# Altium project PCB_intern.PrjPcb
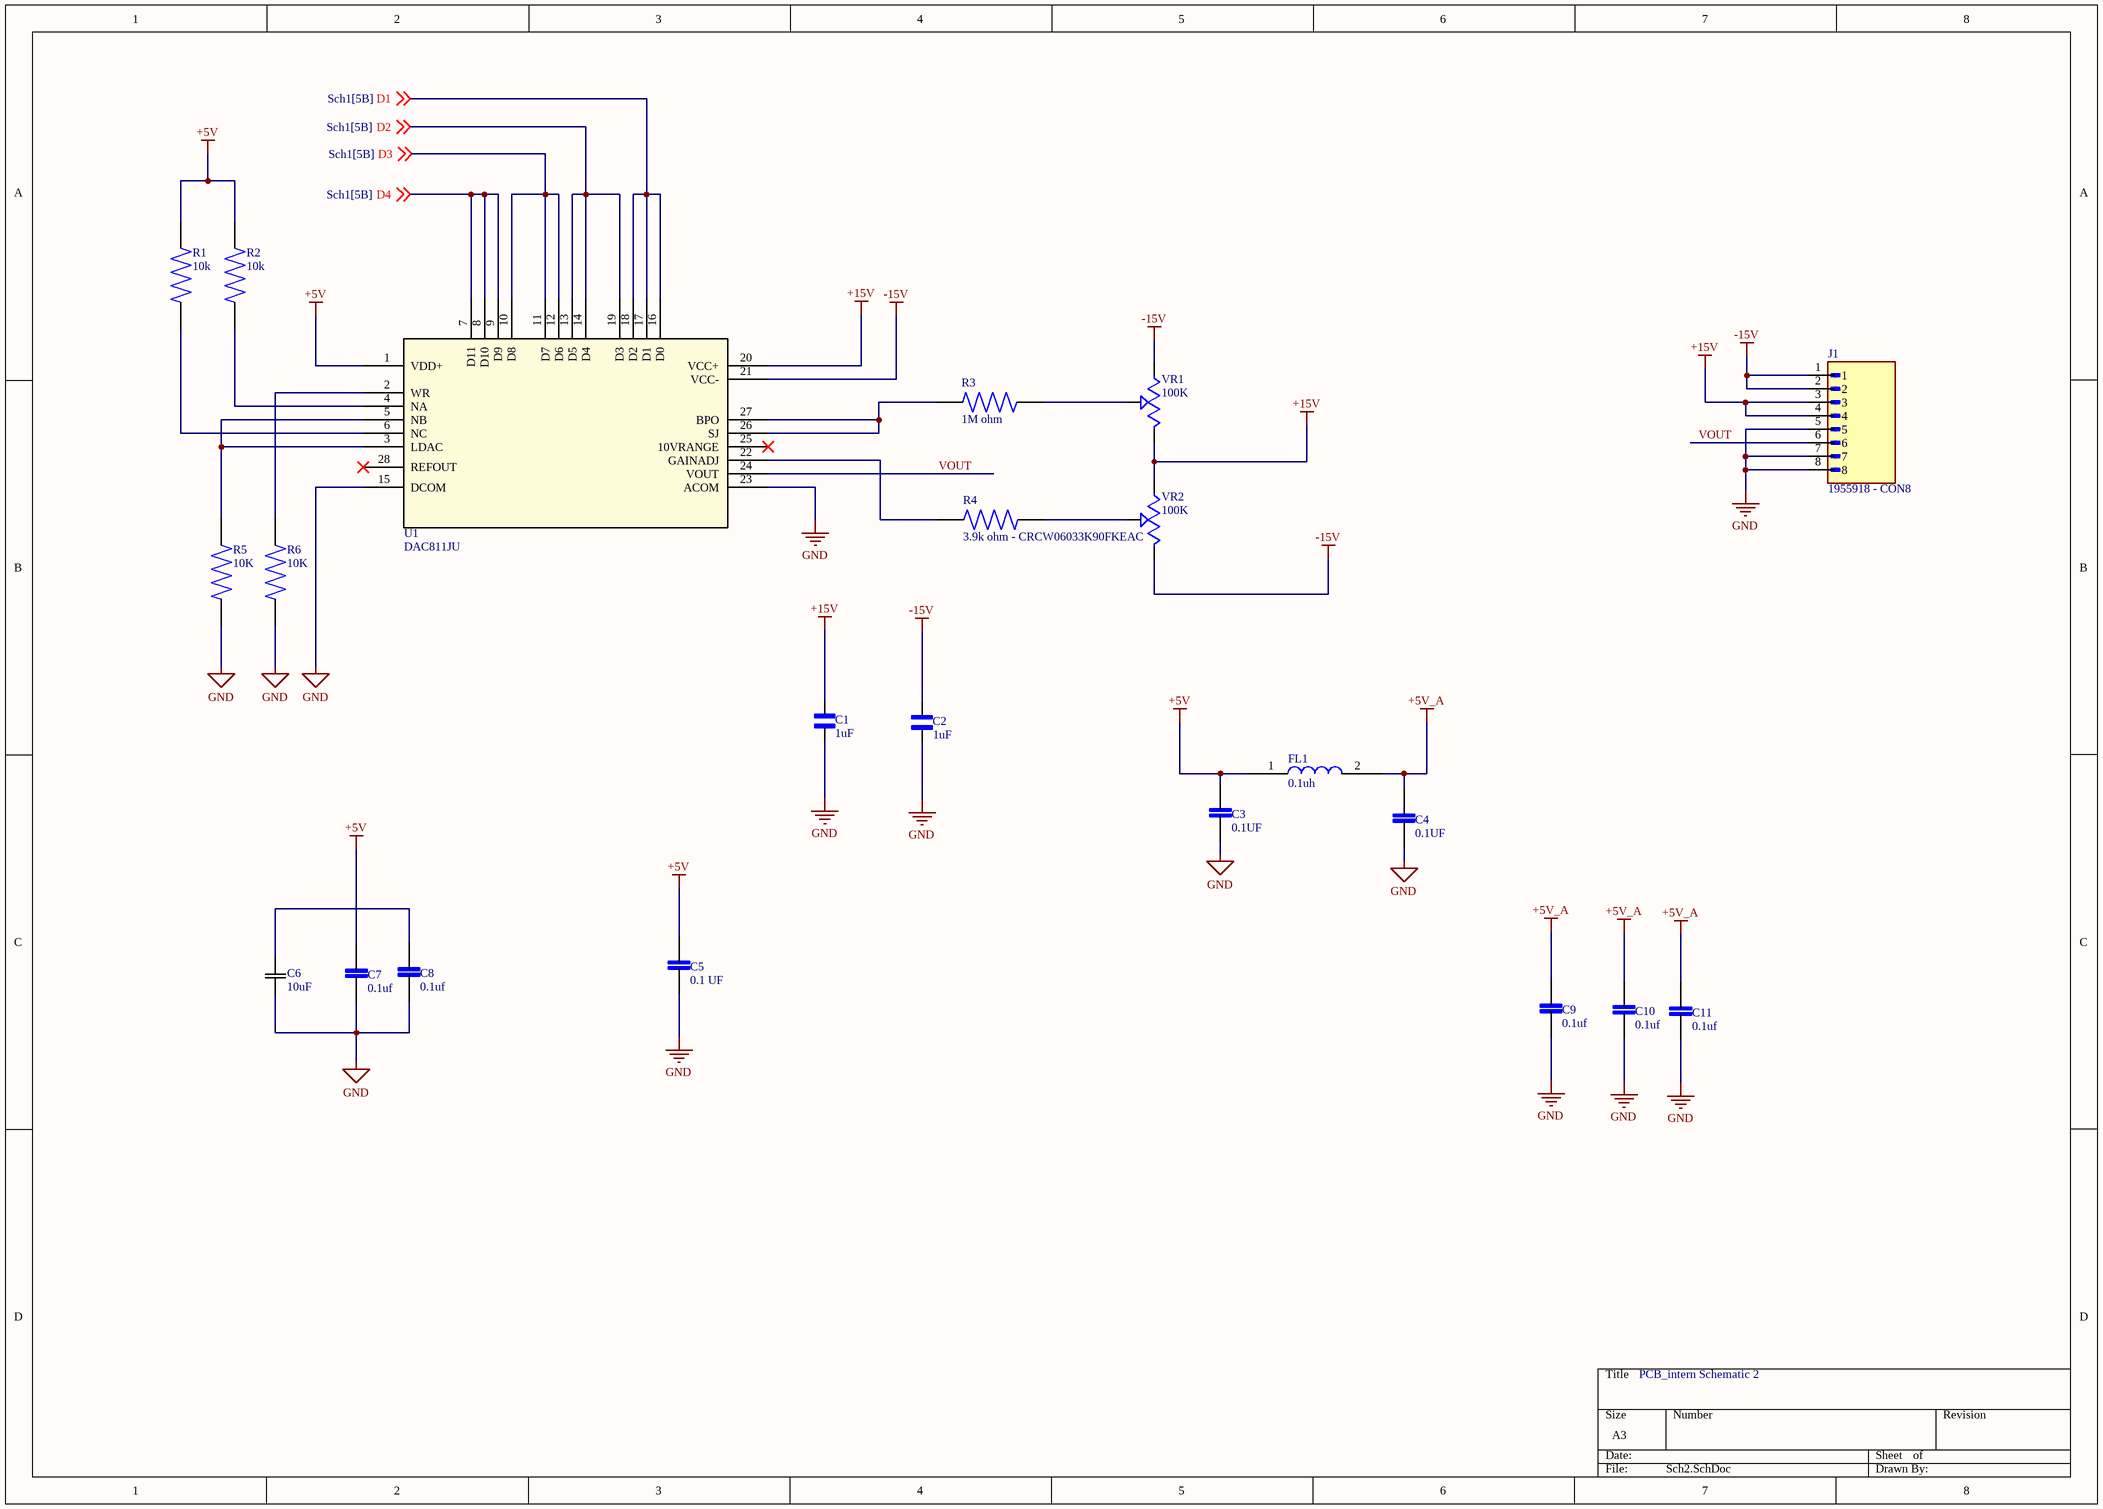
[diagram p0: Sch2.SchDoc]
2 sheets, 57 parts. Net scope: global (net labels, ports and power ports of the same name join across sheets).
Board file: PCB1.PcbDoc
Sheets:
  Sch2.SchDoc
  Sch1.SchDoc

## Sheet Sch2.SchDoc
size A3; SheetNumber: 1; SheetTotal: 2

### Parts
C1  1uF  [VARC3216X85N]
C2  1uF  [VARC3216X85N]
C3  0.1UF  [CAPC1608X90]
C4  0.1UF  [CAPC1608X90]
C5  0.1 UF  [CAPC1608X90]
C6  10uF  [CAP_TCJ-C-2312_KAV]
C7  0.1uf  [CAPC1608X90]
C8  0.1uf  [CAPC1608X90]
C9  0.1uf  [CAPC1608X90]
C10  0.1uf  [CAPC1608X90]
C11  0.1uf  [CAPC1608X90]
FL1  0.1uh  [BEADC1608X95N]
J1  1955918 - CON8  [PHOENIX_1955918]
R1  10k  [RESC1508X50N]
R2  10k  [RESC1508X50N]
R3  1M ohm  [RESC1508X50N]
R4  3.9k ohm - CRCW06033K90FKEAC  [RESC1608X55N]
R5  10K  [RESC1508X50N]
R6  10K  [RESC1508X50N]
U1  DAC811JU  [DW28]
VR1  100K  [TRIM_3266W-1-104LF]
VR2  100K  [TRIM_3266W-1-104LF]

### Nets
+5V: C3.2 C5.2 C7.2 FL1.1 R1.2 R2.2 U1.1(VDD+)
+5V_A: C4.2 C9.2 C10.2 C11.2 FL1.2
+15V: C1.1 J1.3 J1.4 U1.20(VCC+) VR1.3(CW) VR2.1(CCW)
-15V: C2.1 J1.1 J1.2 U1.21(VCC-) VR1.1(CCW) VR2.3(CW)
GND: C1.2 C2.2 C3.1 C4.1 C5.1 C6.1 C7.1 C8.1 C9.1 C10.1 C11.1 J1.5 J1.7 J1.8 R5.1 R6.1 U1.15(DCOM) U1.23(ACOM)
D1: U1.16(D0) U1.17(D1) U1.18(D2) ; off-sheet D1
D2: U1.13(D5) U1.14(D4) U1.19(D3) ; off-sheet D2
D3: U1.10(D8) U1.11(D7) U1.12(D6) ; off-sheet D3
D4: U1.7(D11) U1.8(D10) U1.9(D9) ; off-sheet D4
VOUT: J1.6 U1.24(VOUT)
NetC6_2: C6.2 C8.2
NetR1_1: R1.1 U1.6(NC)
NetR2_1: R2.1 U1.4(NA)
NetR3_1: R3.1 U1.26(SJ) U1.27(BPO)
NetR3_2: R3.2 VR1.2(WIPER)
NetR4_1: R4.1 U1.22(GAINADJ)
NetR4_2: R4.2 VR2.2(WIPER)
NetR5_2: R5.2 U1.3(LDAC) U1.5(NB)
NetR6_2: R6.2 U1.2(WR)

Not connected (* = marked no-connect by the designer): U1 25(10VRANGE)* 28(REFOUT)*

### Notes on the sheet
- PCB_intern Schematic 2

### Library data of the parts
C1 C2 = 1uF - C1206C104K5RACTU: Capacitor;Ceramic;Cap;.1 uF;Tol+10%;SMT;Vol-Rtg 50V;X7R;TR | KEMET C1206C104K5RACTU; SnapEDA_Link: https://www.snapeda.com/parts/C1206C104K5RACTU/KEMET/view-part/?ref=snap; Package: 1206-2 KEMET; Value: *; MF: KEMET; MP: C1206C104K5RACTU; Check_prices: https://www.snapeda.com/parts/C1206C104K5RACTU/KEMET/view-part/?ref=eda
C3-C5 C7-C11 = 0.1uf - C0603C104K5RACTU: 0.1 ÂµF Â±10% 50V Ceramic Capacitor X7R 0603 (1608 Metric); MF: KEMET; SnapEDA_Link: https://www.snapeda.com/parts/C0603C104K5RACTU/KEMET/view-part/?ref=snap; Package: 603-2 KEMET; Value: *; MP: C0603C104K5RACTU; Check_prices: https://www.snapeda.com/parts/C0603C104K5RACTU/KEMET/view-part/?ref=eda
C6 = 10UF - TCJC106M035R0200E: Description; Manufacturer_Name: KYOCERA AVX; Type: Tantalum-Polymer Capacitors; Copyright: Copyright (C) 2025 Ultra Librarian. All rights reserved.; Manufacturer_Part_Number: TCJC106M035R0200E
FL1 = 0.1uh-BLM18AG601SN1D: 0.1uHz 1 - Ferrite Bead 0603 (1608 Metric) 500mA 380mOhm; MF: Murata; Check_prices: https://www.snapeda.com/parts/BLM18AG601SN1D/Murata/view-part/?ref=eda; SnapEDA_Link: https://www.snapeda.com/parts/BLM18AG601SN1D/Murata/view-part/?ref=snap; Availability: In Stock; Value: *; Price: None; MP: BLM18AG601SN1D; Package: 1608 Murata; Purchase-URL: https://pricing.snapeda.com/search/part/BLM18AG601SN1D/?ref=eda
R1 R2 R5 R6 = 10k ohm - CRCW060310K0FKEA: 10 kOhms Â±1% 0.333W, 1/3W Chip Resistor 0603 (1608 Metric) Automotive AEC-Q200, Pulse Withstanding Thick Film; MF: Vishay; Purchase-URL: https://pricing.snapeda.com/search?q=CRCW060310K0FKEA&ref=eda; Package: 1508 Vishay; Check_prices: https://www.snapeda.com/parts/CRCW060310K0FKEA/Vishay+Dale/view-part/?ref=eda; Value: *; SnapEDA_Link: https://www.snapeda.com/parts/CRCW060310K0FKEA/Vishay+Dale/view-part/?ref=snap; MP: CRCW060310K0FKEA
R3 = 1MHz - CRCW06031M00FKEA: Resistor, Thick Film, 1 Megohms, 0.1 W, 1%, SMT, 0603, TCR 37 ppm/DegC, Cut Tape | Vishay Dale CRCW06031M00FKEA; SnapEDA_Link: https://www.snapeda.com/parts/CRCW06031M00FKEA/Vishay+Dale/view-part/?ref=snap; Package: 1508 Vishay; Value: *; MF: Vishay; MP: CRCW06031M00FKEA; Check_prices: https://www.snapeda.com/parts/CRCW06031M00FKEA/Vishay+Dale/view-part/?ref=eda
U1 = U3 - DAC811JU: 12-bit Digital-to-Analog Converter w/Parallel Interface 28-SOIC 0 to 70; Manufacturer_Name: Texas Instruments; Copyright: Copyright (C) 2026 Ultra Librarian. All rights reserved.; Manufacturer_Part_Number: DAC811JU; Datasheet: https://www.ti.com/lit/gpn/dac811; RefDes: RefDes; Type: Type
VR1 VR2 = 100K variable res - 3266W-1-104LF: 100 kOhms 0.25W, 1/4W PC Pins Through Hole Trimmer Potentiometer Cermet 12 Turn Top Adjustment; MF: Bourns; MP: 3266W-1-104LF; Price: None; Package: TO-218 Bourns; Check_prices: https://www.snapeda.com/parts/3266W-1-104LF/Bourns/view-part/378417/?ref=eda; Value: *; Availability: In Stock; SnapEDA_Link: https://www.snapeda.com/parts/3266W-1-104LF/Bourns/view-part/378417/?ref=snap
J1 = 1955918 - CON8: Package: None; Price: None; Value: *; MP: 1955918; Availability: Unavailable
R4 = 3.9k ohm - CRCW06033K90FKEAC: Package: None; Price: None; Value: *; MP: CRCW06033K90FKEAC; Availability: Unavailable

## Sheet Sch1.SchDoc
size A3; SheetNumber: 2; SheetTotal: 2
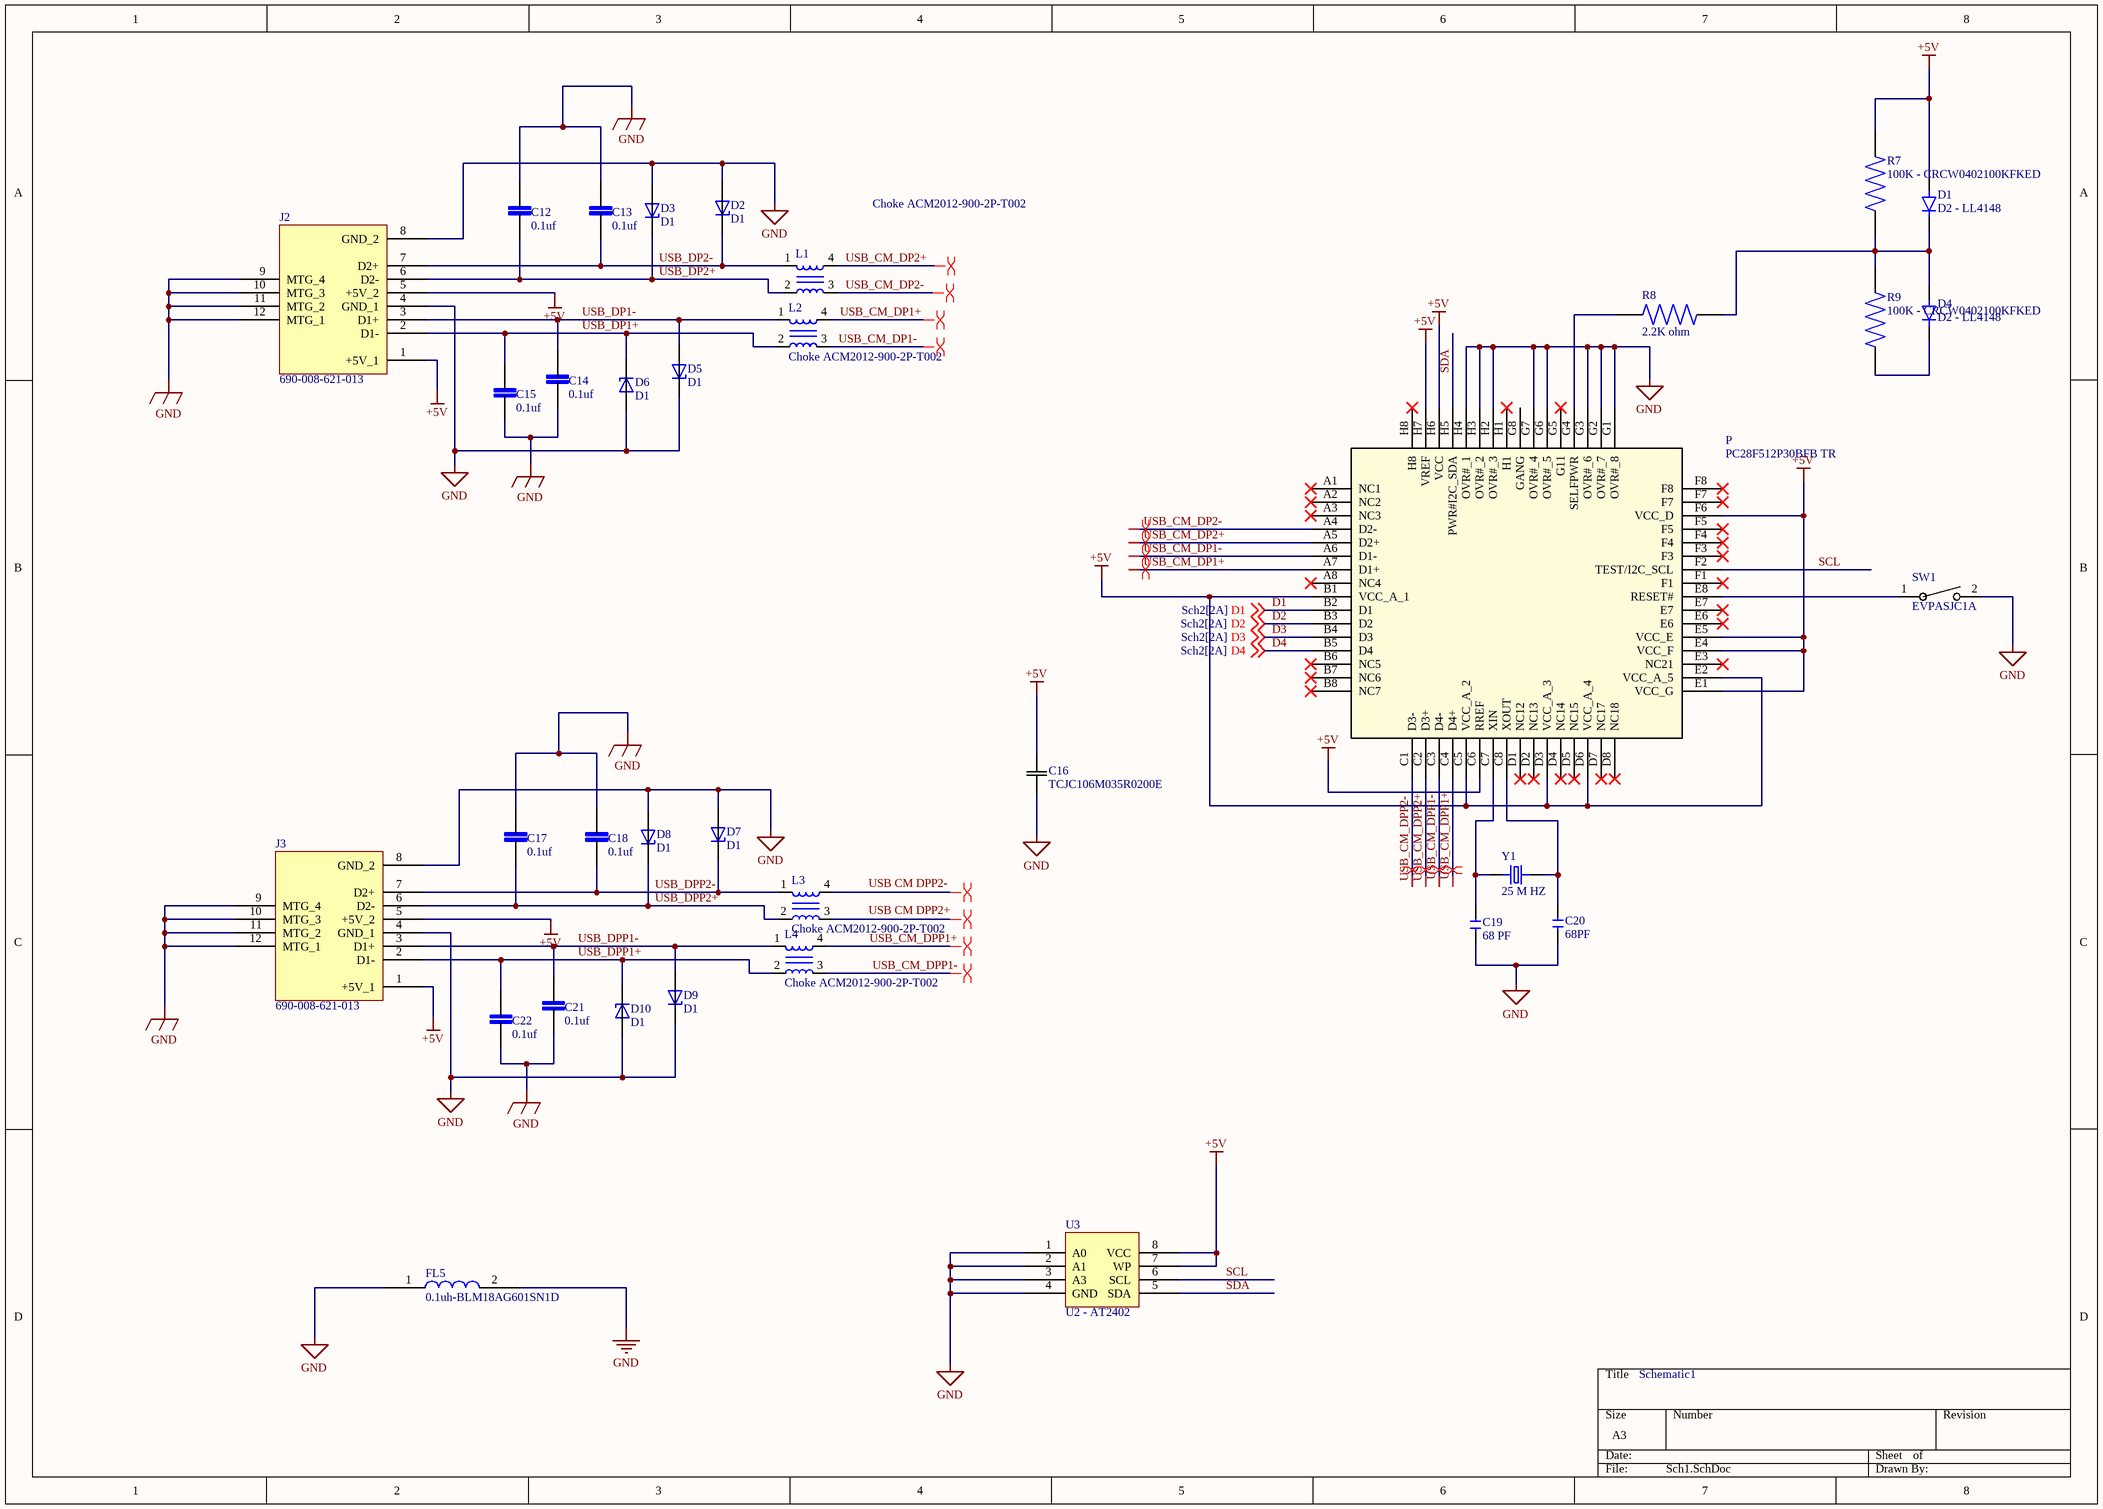
[diagram p1: Sch1.SchDoc]

### Parts
C12  0.1uf  [CAPC1608X90]
C13  0.1uf  [CAPC1608X90]
C14  0.1uf  [CAPC1608X90]
C15  0.1uf  [CAPC1608X90]
C16  TCJC106M035R0200E  [CAP_TCJ-C-2312_KAV]
C17  0.1uf  [CAPC1608X90]
C18  0.1uf  [CAPC1608X90]
C19  68 PF  [C0603]
C20  68PF  [C0603]
C21  0.1uf  [CAPC1608X90]
C22  0.1uf  [CAPC1608X90]
D1  D2 - LL4148  [DIO_LL4148]
D2  D1  [DIOM5336X265N]
D3  D1  [DIOM5336X265N]
D4  D2 - LL4148  [DIO_LL4148]
D5  D1  [DIOM5336X265N]
D6  D1  [DIOM5336X265N]
D7  D1  [DIOM5336X265N]
D8  D1  [DIOM5336X265N]
D9  D1  [DIOM5336X265N]
D10  D1  [DIOM5336X265N]
FL5  0.1uh-BLM18AG601SN1D  [BEADC1608X95N]
J2  690-008-621-013  [CONN8_690-008_EDA]
J3  690-008-621-013  [CONN8_690-008_EDA]
L1  Choke ACM2012-900-2P-T002  [FIL_ACM2012-900-2P-T002]
L2  Choke ACM2012-900-2P-T002  [FIL_ACM2012-900-2P-T002]
L3  Choke ACM2012-900-2P-T002  [FIL_ACM2012-900-2P-T002]
L4  Choke ACM2012-900-2P-T002  [FIL_ACM2012-900-2P-T002]
P  PC28F512P30BFB TR  [BGA64_8X10_MRN]
R7  100K - CRCW0402100KFKED  [RESC1005X40N]
R8  2.2K ohm  [RESC1608X55N]
R9  100K - CRCW0402100KFKED  [RESC1005X40N]
SW1  EVPASJC1A  [SW_EVPASJC1A_PAN]
U3  U2 - AT2402  [AT24C02]
Y1  25 M HZ  [XTAL_ECS-150-18-5PXEN]

### Nets
+5V: C16.2 D1.A J2.1(+5V_1) J2.5(+5V_2) J3.1(+5V_1) J3.5(+5V_2) P.B1(VCC_A_1) P.C5(VCC_A_2) P.C6(RREF) P.D3(VCC_A_3) P.D6(VCC_A_4) P.E1(VCC_G) P.E2(VCC_A_5) P.E4(VCC_F) P.E5(VCC_E) P.F6(VCC_D) P.H6(VCC) P.H7(VREF) R7.2 U3.7(WP) U3.8(VCC)
GND: C12.2 C13.2 C14.1 C15.1 C16.1 C17.2 C18.2 C19.1 C20.1 C21.1 C22.1 D2.2(A) D3.2(A) D5.1(K) D6.2(A) D7.2(A) D8.2(A) D9.1(K) D10.2(A) FL5.1 FL5.2 J2.4(GND_1) J2.8(GND_2) J2.9(MTG_4) J2.10(MTG_3) J2.11(MTG_2) J2.12(MTG_1) J3.4(GND_1) J3.8(GND_2) J3.9(MTG_4) J3.10(MTG_3) J3.11(MTG_2) J3.12(MTG_1) P.G1(OVR#_8) P.G2(OVR#_7) P.G3(OVR#_6) P.G6(OVR#_5) P.G7(OVR#_4) P.H2(OVR#_3) P.H3(OVR#_2) P.H4(OVR#_1) SW1.2 U3.1(A0) U3.2(A1) U3.3(A3) U3.4(GND)
D1: P.B2(D1) ; off-sheet D1
D2: P.B3(D2) ; off-sheet D2
D3: P.B4(D3) ; off-sheet D3
D4: P.B5(D4) ; off-sheet D4
SCL: P.F2(TEST/I2C_SCL) U3.6(SCL)
SDA: P.H5(PWR#I2C_SDA) U3.5(SDA)
USB_CM_DP1+: L2.4 P.A7(D1+)
USB_CM_DP1-: L2.3 P.A6(D1-)
USB_CM_DP2+: L1.4 P.A5(D2+)
USB_CM_DP2-: L1.3 P.A4(D2-)
USB_CM_DPP1+: L4.4 P.C4(D4+)
USB_CM_DPP1-: L4.3 P.C3(D4-)
USB_CM_DPP2+: P.C2(D3+)
USB_CM_DPP2-: P.C1(D3-)
USB_DP1+: C15.2 D6.1(K) J2.2(D1-) L2.2
USB_DP1-: C14.2 D5.2(A) J2.3(D1+) L2.1
USB_DP2+: C12.1 D3.1(K) J2.6(D2-) L1.2
USB_DP2-: C13.1 D2.1(K) J2.7(D2+) L1.1
USB_DPP1+: C22.2 D10.1(K) J3.2(D1-) L4.2
USB_DPP1-: C21.2 D9.2(A) J3.3(D1+) L4.1
USB_DPP2+: C17.1 D8.1(K) J3.6(D2-) L3.2
USB_DPP2-: C18.1 D7.1(K) J3.7(D2+) L3.1
NetC19_2: C19.2 P.C7(XIN) Y1.1
NetC20_2: C20.2 P.C8(XOUT) Y1.2
NetD1_C: D1.C D4.A R7.1 R8.2 R9.2
NetD4_C: D4.C R9.1
NetP_E8: P.E8(RESET#) SW1.1
NetP_G4: P.G4(SELFPWR) R8.1

Not connected (* = marked no-connect by the designer): L3 3 4; P A1(NC1)* A2(NC2)* A3(NC3)* A8(NC4)* B6(NC5)* B7(NC6)* B8(NC7)* D1(NC12)* D2(NC13)* D4(NC14)* D5(NC15)* D7(NC17)* D8(NC18)* E3(NC21)* E6* E7* F1* F3* F4* F5* F7* F8* G5(G11)* G8(GANG) H1* H8*

### Layout directives
differential pair: NetL3_3, NetL3_4, USB_CM_DP1+, USB_CM_DP1-, USB_CM_DP2+, USB_CM_DP2-, USB_CM_DPP1+, USB_CM_DPP1-, USB_CM_DPP2+, USB_CM_DPP2-

### Notes on the sheet
- Schematic1
- Labels drawn without touching a wire or pin: USB CM DPP2+, USB CM DPP2-

### Library data of the parts
C12-C15 C17 C18 C21 C22 = 0.1uf - C0603C104K5RACTU: as C3 on sheet Sch2; SnapEDA_Link: https://www.snapeda.com/parts/C0603C104K5RACTU/KEMET/view-part/?ref=snap; Package: 603-2 KEMET; Value: *; MP: C0603C104K5RACTU; Check_prices: https://www.snapeda.com/parts/C0603C104K5RACTU/KEMET/view-part/?ref=eda
C16 = 10UF - TCJC106M035R0200E: as C6 on sheet Sch2; Copyright: Copyright (C) 2025 Ultra Librarian. All rights reserved.; Manufacturer_Part_Number: TCJC106M035R0200E
C19 C20 = 68 PF - CERAMIC-68PF-50V-5%-NPO(0603): 68 pF Â±5% 50V Ceramic Capacitor C0G, NP0 0603 (1608 Metric); MF: Yageo; MP: CC0603JRNPO9BN680; SnapEDA_Link: https://www.snapeda.com/parts/CC0603JRNPO9BN680/Yageo/view-part/?ref=snap; Package: 0603 Yageo; Value: *; Check_prices: https://www.snapeda.com/parts/CC0603JRNPO9BN680/Yageo/view-part/?ref=eda
D1 D4 = D2 - LL4148: Small Signal Diode, SOD-80, 100V, 0.15A, 175Â°C; MF: Diotec Semiconductor; SnapEDA_Link: https://www.snapeda.com/parts/LL4148/Diotec/view-part/?ref=snap; Package: SOD-80 Diotec; Value: *; MP: LL4148; Check_prices: https://www.snapeda.com/parts/LL4148/Diotec/view-part/?ref=eda
D2 D3 D5-D10 = D1 - SM6T6V8A: 13.4V Clamp 298A (8/20Âµs) Ipp Tvs Diode Surface Mount SMB (DO-214AA); MF: STMicroelectronics; SnapEDA_Link: https://www.snapeda.com/parts/SM6T6V8A/STMicroelectronics/view-part/?ref=snap; Package: DO-214 STMicroelectronics; Value: *; MP: SM6T6V8A; Check_prices: https://www.snapeda.com/parts/SM6T6V8A/STMicroelectronics/view-part/?ref=eda
FL5 = 0.1uh-BLM18AG601SN1D: as FL1 on sheet Sch2; Check_prices: https://www.snapeda.com/parts/BLM18AG601SN1D/Murata/view-part/?ref=eda; SnapEDA_Link: https://www.snapeda.com/parts/BLM18AG601SN1D/Murata/view-part/?ref=snap; Availability: In Stock; Value: *; Price: None; MP: BLM18AG601SN1D; Package: 1608 Murata; Purchase-URL: https://pricing.snapeda.com/search/part/BLM18AG601SN1D/?ref=eda
J2 J3 = J- 690-008-621-013: Description; Manufacturer_Name: EDAC; Type: USB, DVI, HDMI, Connectors; Copyright: Copyright (C) 2025 Ultra Librarian. All rights reserved.; Manufacturer_Part_Number: 690-008-621-013; RefDes: RefDes
L1-L4 = Choke ACM2012-900-2P-T002: 2 Line Common Mode Choke Surface Mount 90 Ohms @ 100MHz 400mA DCR 190mOhm; MF: TDK; SnapEDA_Link: https://www.snapeda.com/parts/ACM2012-900-2P-T002/TDK/view-part/12425/?ref=snap; Availability: Unavailable; MP: ACM2012-900-2P-T002; Price: None; Value: *; Package: Horizontal-4 TDK
P = U1 - PC28F512P30BFB TR: No Description Available; Manufacturer_Name: Micron; Copyright: Copyright (C) 2026 Ultra Librarian. All rights reserved.; Manufacturer_Part_Number: PC28F512P30BFB TR; RefDes: RefDes; Type: Type
R7 R9 = 100K - CRCW0402100KFKED: Resistor, Thick Film, 100 Kilohms, 0.063 W, 1%, SMT, 0402, TCR 37 ppm/DegC, TR | Vishay Dale CRCW0402100KFKED; SnapEDA_Link: https://www.snapeda.com/parts/CRCW0402100KFKED/Vishay+Dale/view-part/?ref=snap; Package: 1005 Panasonic Electronic Components; Value: *; MF: Vishay; MP: CRCW0402100KFKED; Check_prices: https://www.snapeda.com/parts/CRCW0402100KFKED/Vishay+Dale/view-part/?ref=eda
R8 = 2.2K ohm - CRCW06032K20FKEAC: 2.2 kOhms Â±1% 0.1W, 1/10W Chip Resistor 0603 (1608 Metric) - Thick Film; MF: Vishay Dale; SnapEDA_Link: https://www.snapeda.com/parts/CRCW06032K20FKEAC/Vishay+Dale/view-part/?ref=snap; Package: 0603-2 Vishay; Value: *; MP: CRCW06032K20FKEAC; Check_prices: https://www.snapeda.com/parts/CRCW06032K20FKEAC/Vishay+Dale/view-part/?ref=eda
SW1 = SW - EVPASJC1A: Description; Manufacturer_Name: Panasonic; Copyright: Copyright (C) 2026 Ultra Librarian. All rights reserved.; Manufacturer_Part_Number: EVPASJC1A
Y1 = 25 HZ- ECS-150-18-5PXEN: CRYSTAL SMD; Package: None; Price: None; Value: *; MP: ECS-150-18-5PXEN; Availability: Unavailable

## Nets that join several sheets
+5V: Sch2 (7 pins), Sch1 (21 pins)
GND: Sch2 (18 pins), Sch1 (46 pins)
D1: Sch2 (U1.16 U1.17 U1.18), Sch1 (P.B2)
D2: Sch2 (U1.13 U1.14 U1.19), Sch1 (P.B3)
D3: Sch2 (U1.10 U1.11 U1.12), Sch1 (P.B4)
D4: Sch2 (U1.7 U1.8 U1.9), Sch1 (P.B5)